# Altium schematic sheet 20220516_Keyboard_V0.2.SchDoc
size A2
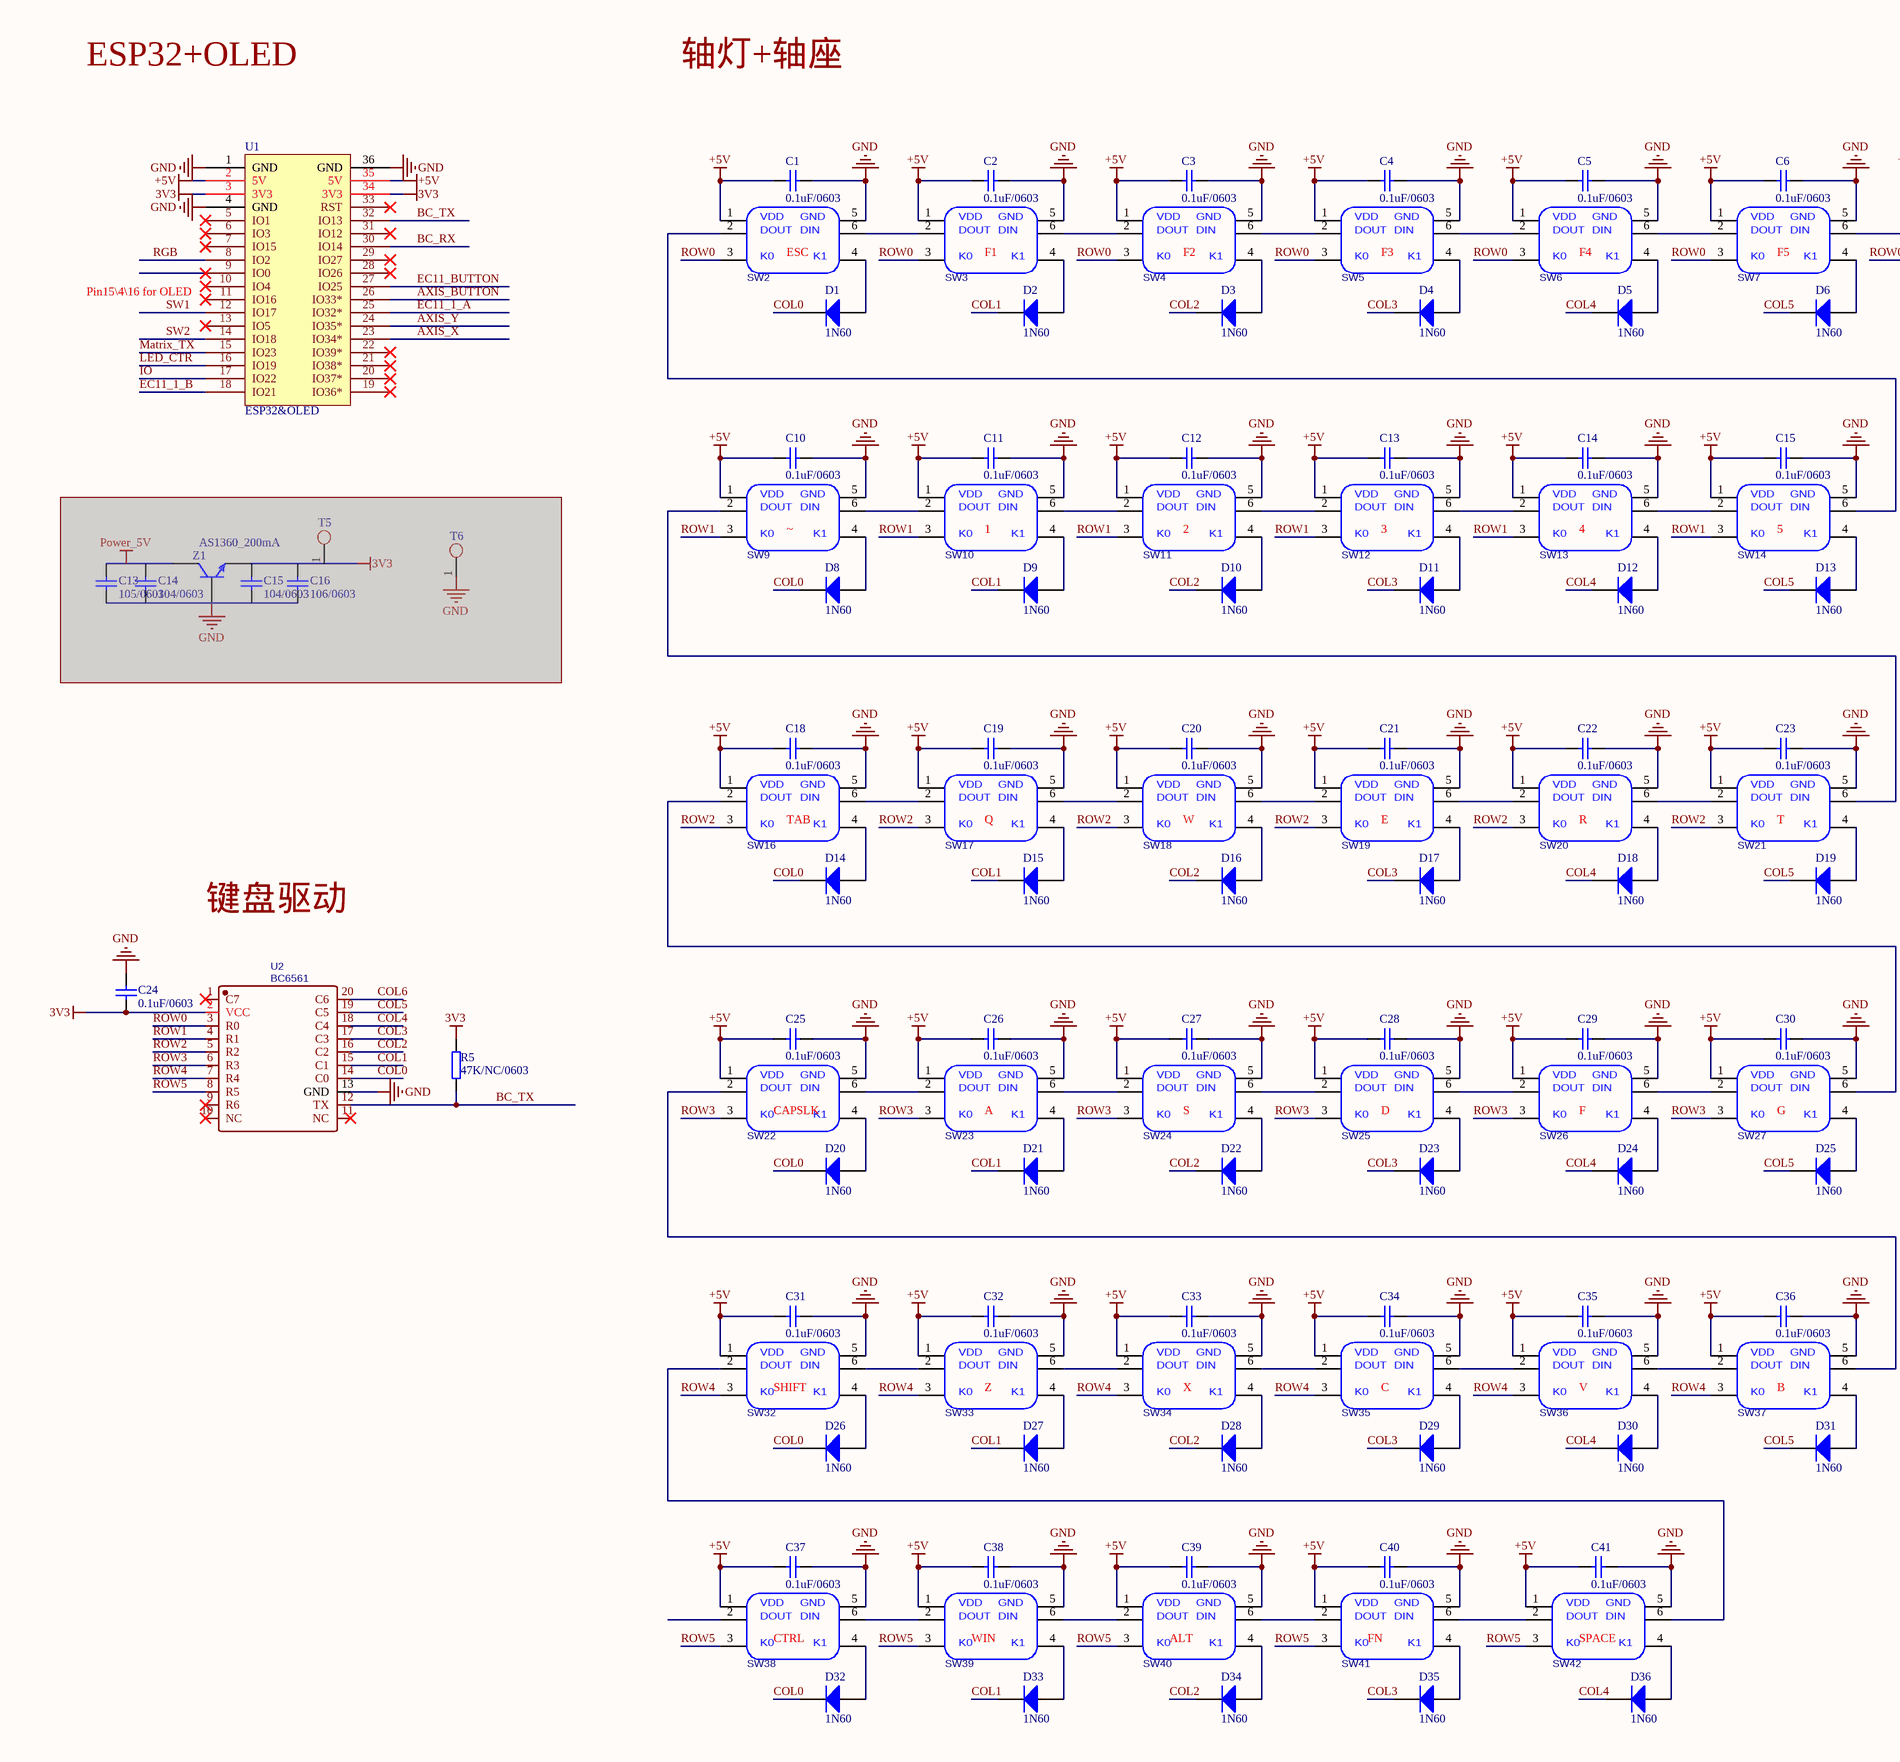
[diagram p0: 20220516_Keyboard_V0.2.SchDoc, left]
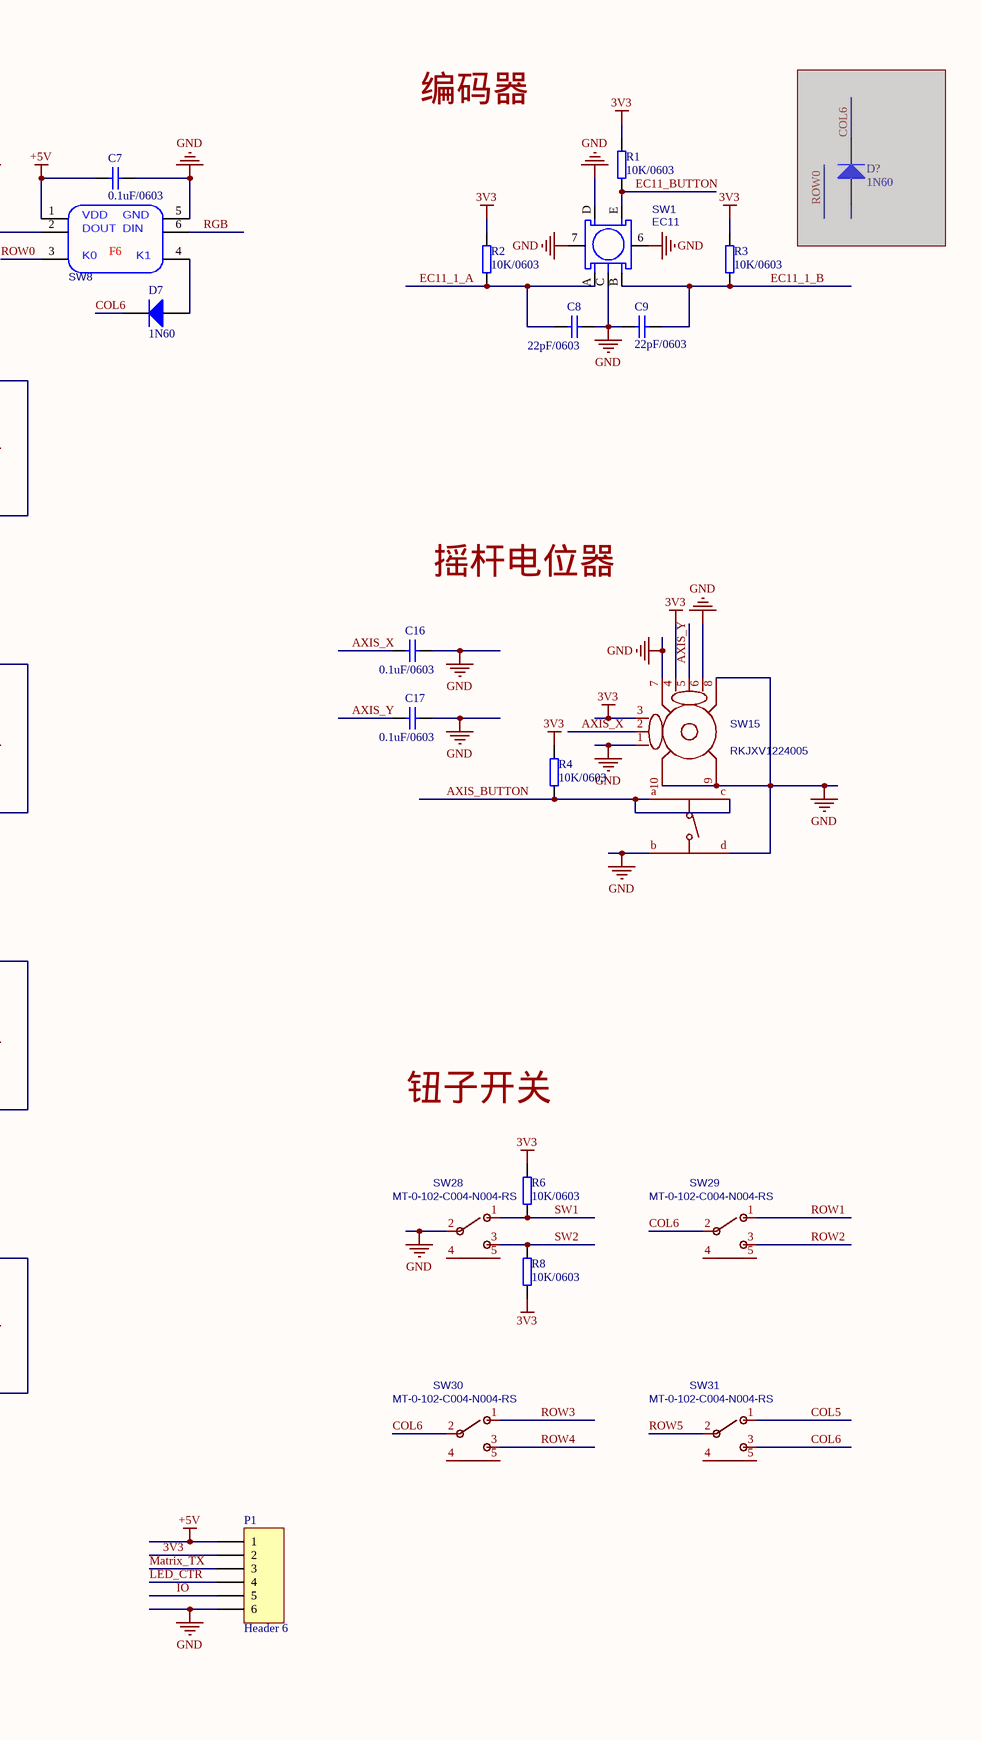
[diagram p1: 20220516_Keyboard_V0.2.SchDoc, right]

## Parts
(Parts that share a designator on the sheet are numbered #1, #2 ... from top to bottom, then left to right.)
C1  0.1uF/0603  [C 0603_L]
C2  0.1uF/0603  [C 0603_L]
C3  0.1uF/0603  [C 0603_L]
C4  0.1uF/0603  [C 0603_L]
C5  0.1uF/0603  [C 0603_L]
C6  0.1uF/0603  [C 0603_L]
C7  0.1uF/0603  [C 0603_L]
C8  22pF/0603  [C 0603_L]
C9  22pF/0603  [C 0603_L]
C10  0.1uF/0603  [C 0603_L]
C11  0.1uF/0603  [C 0603_L]
C12  0.1uF/0603  [C 0603_L]
C13#1  0.1uF/0603  [C 0603_L]
C13#2  105/0603  [C0603]  (masked out: inside a compile mask, not in the netlist)
C14#1  0.1uF/0603  [C 0603_L]
C14#2  104/0603  [C0603]  (masked out: inside a compile mask, not in the netlist)
C15#1  0.1uF/0603  [C 0603_L]
C15#2  104/0603  [C0603]  (masked out: inside a compile mask, not in the netlist)
C16#1  106/0603  [C0603]  (masked out: inside a compile mask, not in the netlist)
C16#2  0.1uF/0603  [C 0603_L]
C17  0.1uF/0603  [C 0603_L]
C18  0.1uF/0603  [C 0603_L]
C19  0.1uF/0603  [C 0603_L]
C20  0.1uF/0603  [C 0603_L]
C21  0.1uF/0603  [C 0603_L]
C22  0.1uF/0603  [C 0603_L]
C23  0.1uF/0603  [C 0603_L]
C24  0.1uF/0603  [C 0603_L]
C25  0.1uF/0603  [C 0603_L]
C26  0.1uF/0603  [C 0603_L]
C27  0.1uF/0603  [C 0603_L]
C28  0.1uF/0603  [C 0603_L]
C29  0.1uF/0603  [C 0603_L]
C30  0.1uF/0603  [C 0603_L]
C31  0.1uF/0603  [C 0603_L]
C32  0.1uF/0603  [C 0603_L]
C33  0.1uF/0603  [C 0603_L]
C34  0.1uF/0603  [C 0603_L]
C35  0.1uF/0603  [C 0603_L]
C36  0.1uF/0603  [C 0603_L]
C37  0.1uF/0603  [C 0603_L]
C38  0.1uF/0603  [C 0603_L]
C39  0.1uF/0603  [C 0603_L]
C40  0.1uF/0603  [C 0603_L]
C41  0.1uF/0603  [C 0603_L]
D1  1N60  [SOD-323]
D2  1N60  [SOD-323]
D3  1N60  [SOD-323]
D4  1N60  [SOD-323]
D5  1N60  [SOD-323]
D6  1N60  [SOD-323]
D7  1N60  [SOD-323]
D8  1N60  [SOD-323]
D9  1N60  [SOD-323]
D10  1N60  [SOD-323]
D11  1N60  [SOD-323]
D12  1N60  [SOD-323]
D13  1N60  [SOD-323]
D14  1N60  [SOD-323]
D15  1N60  [SOD-323]
D16  1N60  [SOD-323]
D17  1N60  [SOD-323]
D18  1N60  [SOD-323]
D19  1N60  [SOD-323]
D20  1N60  [SOD-323]
D21  1N60  [SOD-323]
D22  1N60  [SOD-323]
D23  1N60  [SOD-323]
D24  1N60  [SOD-323]
D25  1N60  [SOD-323]
D26  1N60  [SOD-323]
D27  1N60  [SOD-323]
D28  1N60  [SOD-323]
D29  1N60  [SOD-323]
D30  1N60  [SOD-323]
D31  1N60  [SOD-323]
D32  1N60  [SOD-323]
D33  1N60  [SOD-323]
D34  1N60  [SOD-323]
D35  1N60  [SOD-323]
D36  1N60  [SOD-323]
D?  1N60  [SOD-323]  (masked out: inside a compile mask, not in the netlist)
P1  Header 6  [HDR1X6]
R1  10K/0603  [R 0603_M]
R2  10K/0603  [R 0603_M]
R3  10K/0603  [R 0603_M]
R4  10K/0603  [R 0603_M]
R5  47K/NC/0603  [R 0603_M]
R6  10K/0603  [R 0603_M]
R8  10K/0603  [R 0603_M]
SW1  EC11  [EC11-B1]
SW2  凯华轴座+3528反贴灯  [轴座+3528反贴灯]  (value not drawn)
SW3  凯华轴座+3528反贴灯  [轴座+3528反贴灯]  (value not drawn)
SW4  凯华轴座+3528反贴灯  [轴座+3528反贴灯]  (value not drawn)
SW5  凯华轴座+3528反贴灯  [轴座+3528反贴灯]  (value not drawn)
SW6  凯华轴座+3528反贴灯  [轴座+3528反贴灯]  (value not drawn)
SW7  凯华轴座+3528反贴灯  [轴座+3528反贴灯]  (value not drawn)
SW8  凯华轴座+3528反贴灯  [轴座+3528反贴灯]  (value not drawn)
SW9  凯华轴座+3528反贴灯  [轴座+3528反贴灯]  (value not drawn)
SW10  凯华轴座+3528反贴灯  [轴座+3528反贴灯]  (value not drawn)
SW11  凯华轴座+3528反贴灯  [轴座+3528反贴灯]  (value not drawn)
SW12  凯华轴座+3528反贴灯  [轴座+3528反贴灯]  (value not drawn)
SW13  凯华轴座+3528反贴灯  [轴座+3528反贴灯]  (value not drawn)
SW14  凯华轴座+3528反贴灯  [轴座+3528反贴灯]  (value not drawn)
SW15  RKJXV1224005  [摇杆电位器]
SW16  凯华轴座+3528反贴灯  [轴座+3528反贴灯]  (value not drawn)
SW17  凯华轴座+3528反贴灯  [轴座+3528反贴灯]  (value not drawn)
SW18  凯华轴座+3528反贴灯  [轴座+3528反贴灯]  (value not drawn)
SW19  凯华轴座+3528反贴灯  [轴座+3528反贴灯]  (value not drawn)
SW20  凯华轴座+3528反贴灯  [轴座+3528反贴灯]  (value not drawn)
SW21  凯华轴座+3528反贴灯  [轴座+3528反贴灯]  (value not drawn)
SW22  凯华轴座+3528反贴灯  [轴座+3528反贴灯]  (value not drawn)
SW23  凯华轴座+3528反贴灯  [轴座+3528反贴灯]  (value not drawn)
SW24  凯华轴座+3528反贴灯  [轴座+3528反贴灯]  (value not drawn)
SW25  凯华轴座+3528反贴灯  [轴座+3528反贴灯]  (value not drawn)
SW26  凯华轴座+3528反贴灯  [轴座+3528反贴灯]  (value not drawn)
SW27  凯华轴座+3528反贴灯  [轴座+3528反贴灯]  (value not drawn)
SW28  MT-0-102-C004-N004-RS  [钮子开关三脚二档]
SW29  MT-0-102-C004-N004-RS  [钮子开关三脚二档]
SW30  MT-0-102-C004-N004-RS  [钮子开关三脚二档]
SW31  MT-0-102-C004-N004-RS  [钮子开关三脚二档]
SW32  凯华轴座+3528反贴灯  [轴座+3528反贴灯]  (value not drawn)
SW33  凯华轴座+3528反贴灯  [轴座+3528反贴灯]  (value not drawn)
SW34  凯华轴座+3528反贴灯  [轴座+3528反贴灯]  (value not drawn)
SW35  凯华轴座+3528反贴灯  [轴座+3528反贴灯]  (value not drawn)
SW36  凯华轴座+3528反贴灯  [轴座+3528反贴灯]  (value not drawn)
SW37  凯华轴座+3528反贴灯  [轴座+3528反贴灯]  (value not drawn)
SW38  凯华轴座+3528反贴灯  [轴座+3528反贴灯]  (value not drawn)
SW39  凯华轴座+3528反贴灯  [轴座+3528反贴灯]  (value not drawn)
SW40  凯华轴座+3528反贴灯  [轴座+3528反贴灯]  (value not drawn)
SW41  凯华轴座+3528反贴灯  [轴座+3528反贴灯]  (value not drawn)
SW42  凯华轴座+3528反贴灯  [轴座+3528反贴灯]  (value not drawn)
T5  (no value)  [test-1]  (masked out: inside a compile mask, not in the netlist)
T6  (no value)  [test-1]  (masked out: inside a compile mask, not in the netlist)
U1  ESP32&OLED  [ESP32+OLED]
U2  BC6561  [SSOP-20_L7.5-W5.2-P0.65-LS8.0-BL]
Z1  AS1360_200mA  [SOT-23]  (masked out: inside a compile mask, not in the netlist)

## Nets
3V3: C24.2 P1.2 R1.1 R2.1 R3.2 R4.1 R5.1 R6.1 R8.1 SW15.3(A) SW15.4(A) U1.3(3V3) U1.34(3V3) U2.2(VCC)
+5V: C1.2 C2.2 C3.2 C4.2 C5.2 C6.2 C7.2 C10.2 C11.2 C12.2 C13#1.2 C14#1.2 C15#1.2 C18.2 C19.2 C20.2 C21.2 C22.2 C23.2 C25.2 C26.2 C27.2 C28.2 C29.2 C30.2 C31.2 C32.2 C33.2 C34.2 C35.2 C36.2 C37.2 C38.2 C39.2 C40.2 C41.2 P1.1 SW2.1 SW3.1 SW4.1 SW5.1 SW6.1 SW7.1 SW8.1 SW9.1 SW10.1 SW11.1 SW12.1 SW13.1 SW14.1 SW16.1 SW17.1 SW18.1 SW19.1 SW20.1 SW21.1 SW22.1 SW23.1 SW24.1 SW25.1 SW26.1 SW27.1 SW32.1 SW33.1 SW34.1 SW35.1 SW36.1 SW37.1 SW38.1 SW39.1 SW40.1 SW41.1 SW42.1 U1.2(5V) U1.35(5V)
GND: C1.1 C2.1 C3.1 C4.1 C5.1 C6.1 C7.1 C8.1 C9.2 C10.1 C11.1 C12.1 C13#1.1 C14#1.1 C15#1.1 C16#2.1 C17.1 C18.1 C19.1 C20.1 C21.1 C22.1 C23.1 C24.1 C25.1 C26.1 C27.1 C28.1 C29.1 C30.1 C31.1 C32.1 C33.1 C34.1 C35.1 C36.1 C37.1 C38.1 C39.1 C40.1 C41.1 P1.6 SW1.6 SW1.7 SW1.C SW1.D SW2.5 SW3.5 SW4.5 SW5.5 SW6.5 SW7.5 SW8.5 SW9.5 SW10.5 SW11.5 SW12.5 SW13.5 SW14.5 SW15.1(B) SW15.6(B) SW15.7(GND) SW15.8(GND) SW15.9(GND) SW15.10(GND) SW15.b SW15.d SW16.5 SW17.5 SW18.5 SW19.5 SW20.5 SW21.5 SW22.5 SW23.5 SW24.5 SW25.5 SW26.5 SW27.5 SW28.2 SW32.5 SW33.5 SW34.5 SW35.5 SW36.5 SW37.5 SW38.5 SW39.5 SW40.5 SW41.5 SW42.5 U1.1(GND) U1.4(GND) U1.36(GND) U2.13(GND)
AXIS_BUTTON: R4.2 SW15.a SW15.c U1.26(IO33*)
AXIS_X: C16#2.2 SW15.2(DTA) U1.23(IO34*)
AXIS_Y: C17.2 SW15.5(DTA) U1.24(IO35*)
BC_RX: U1.30(IO14)
BC_TX: R5.2 U1.32(IO13) U2.12(TX)
COL0: D1.2 D8.2 D14.2 D20.2 D26.2 D32.2 U2.14(C0)
COL1: D2.2 D9.2 D15.2 D21.2 D27.2 D33.2 U2.15(C1)
COL2: D3.2 D10.2 D16.2 D22.2 D28.2 D34.2 U2.16(C2)
COL3: D4.2 D11.2 D17.2 D23.2 D29.2 D35.2 U2.17(C3)
COL4: D5.2 D12.2 D18.2 D24.2 D30.2 D36.2 U2.18(C4)
COL5: D6.2 D13.2 D19.2 D25.2 D31.2 SW31.1 U2.19(C5)
COL6: D7.2 SW29.2 SW30.2 SW31.3 U2.20(C6)
EC11_1_A: C8.2 R2.2 SW1.A U1.25(IO32*)
EC11_1_B: C9.1 R3.1 SW1.B U1.18(IO21)
EC11_BUTTON: R1.2 SW1.E U1.27(IO25)
IO: P1.5 U1.17(IO22)
LED_CTR: P1.4 U1.16(IO19)
Matrix_TX: P1.3 U1.15(IO23)
RGB: SW8.6 U1.8(IO2)
ROW0: SW2.3 SW3.3 SW4.3 SW5.3 SW6.3 SW7.3 SW8.3 U2.3(R0)
ROW1: SW9.3 SW10.3 SW11.3 SW12.3 SW13.3 SW14.3 SW29.1 U2.4(R1)
ROW2: SW16.3 SW17.3 SW18.3 SW19.3 SW20.3 SW21.3 SW29.3 U2.5(R2)
ROW3: SW22.3 SW23.3 SW24.3 SW25.3 SW26.3 SW27.3 SW30.1 U2.6(R3)
ROW4: SW30.3 SW32.3 SW33.3 SW34.3 SW35.3 SW36.3 SW37.3 U2.7(R4)
ROW5: SW31.2 SW38.3 SW39.3 SW40.3 SW41.3 SW42.3 U2.8(R5)
SW1: R6.2 SW28.1 U1.12(IO17)
SW2: R8.2 SW28.3 U1.14(IO18)
NetD1_1: D1.1 SW2.4
NetD2_1: D2.1 SW3.4
NetD3_1: D3.1 SW4.4
NetD4_1: D4.1 SW5.4
NetD5_1: D5.1 SW6.4
NetD6_1: D6.1 SW7.4
NetD7_1: D7.1 SW8.4
NetD8_1: D8.1 SW9.4
NetD9_1: D9.1 SW10.4
NetD10_1: D10.1 SW11.4
NetD11_1: D11.1 SW12.4
NetD12_1: D12.1 SW13.4
NetD13_1: D13.1 SW14.4
NetD14_1: D14.1 SW16.4
NetD15_1: D15.1 SW17.4
NetD16_1: D16.1 SW18.4
NetD17_1: D17.1 SW19.4
NetD18_1: D18.1 SW20.4
NetD19_1: D19.1 SW21.4
NetD20_1: D20.1 SW22.4
NetD21_1: D21.1 SW23.4
NetD22_1: D22.1 SW24.4
NetD23_1: D23.1 SW25.4
NetD24_1: D24.1 SW26.4
NetD25_1: D25.1 SW27.4
NetD26_1: D26.1 SW32.4
NetD27_1: D27.1 SW33.4
NetD28_1: D28.1 SW34.4
NetD29_1: D29.1 SW35.4
NetD30_1: D30.1 SW36.4
NetD31_1: D31.1 SW37.4
NetD32_1: D32.1 SW38.4
NetD33_1: D33.1 SW39.4
NetD34_1: D34.1 SW40.4
NetD35_1: D35.1 SW41.4
NetD36_1: D36.1 SW42.4
NetSW2_2: SW2.2 SW14.6
NetSW2_6: SW2.6 SW3.2
NetSW3_6: SW3.6 SW4.2
NetSW4_6: SW4.6 SW5.2
NetSW5_6: SW5.6 SW6.2
NetSW6_6: SW6.6 SW7.2
NetSW7_6: SW7.6 SW8.2
NetSW9_2: SW9.2 SW21.6
NetSW9_6: SW9.6 SW10.2
NetSW10_6: SW10.6 SW11.2
NetSW11_6: SW11.6 SW12.2
NetSW12_6: SW12.6 SW13.2
NetSW13_6: SW13.6 SW14.2
NetSW16_2: SW16.2 SW27.6
NetSW16_6: SW16.6 SW17.2
NetSW17_6: SW17.6 SW18.2
NetSW18_6: SW18.6 SW19.2
NetSW19_6: SW19.6 SW20.2
NetSW20_6: SW20.6 SW21.2
NetSW22_2: SW22.2 SW37.6
NetSW22_6: SW22.6 SW23.2
NetSW23_6: SW23.6 SW24.2
NetSW24_6: SW24.6 SW25.2
NetSW25_6: SW25.6 SW26.2
NetSW26_6: SW26.6 SW27.2
NetSW32_2: SW32.2 SW42.6
NetSW32_6: SW32.6 SW33.2
NetSW33_6: SW33.6 SW34.2
NetSW34_6: SW34.6 SW35.2
NetSW35_6: SW35.6 SW36.2
NetSW36_6: SW36.6 SW37.2
NetSW38_6: SW38.6 SW39.2
NetSW39_6: SW39.6 SW40.2
NetSW40_6: SW40.6 SW41.2
NetSW41_6: SW41.6 SW42.2

Not connected (* = marked no-connect by the designer): SW28 4 5; SW29 4 5; SW30 4 5; SW31 4 5; SW38 2; U1 5(IO1)* 6(IO3)* 7(IO15)* 9(IO0)* 10(IO4)* 11(IO16)* 13(IO5)* 19(IO36*)* 20(IO37*)* 21(IO38*)* 22(IO39*)* 28(IO26)* 29(IO27)* 31(IO12)* 33(RST)*; U2 1(C7)* 9(R6)* 10(NC)* 11(NC)*

## Notes on the sheet
- ESP32+OLED
- 轴灯+轴座
- 编码器
- (near SW2) ESC
- (near SW3) F1
- (near SW4) F2
- (near SW5) F3
- (near SW6) F4
- (near SW7) F5
- (near SW8) F6
- (near U1) Pin15\4\16 for OLED
- (near SW9) ~
- (near SW10) 1
- (near SW11) 2
- (near SW12) 3
- (near SW13) 4
- (near SW14) 5
- 摇杆电位器
- (near SW16) TAB
- (near SW17) Q
- (near SW18) W
- (near SW19) E
- (near SW20) R
- (near SW21) T
- 键盘驱动
- (near SW22) CAPSLK
- (near SW23) A
- (near SW24) S
- (near SW25) D
- (near SW26) F
- (near SW27) G
- 钮子开关
- (near SW32) SHIFT
- (near SW33) Z
- (near SW34) X
- (near SW35) C
- (near SW36) V
- (near SW37) B
- (near SW38) CTRL
- (near SW39) WIN
- (near SW40) ALT
- (near SW41) FN
- (near SW42) SPACE
- (in symbol 凯华轴座+3528反贴灯) VDD; GND; DOUT; DIN; K0; K1

## Library data of the parts
C1-C12 C13#1 C14#1 C15#1 C16#2 C17-C41 = Cap: Capacitor; Published: 8-Jun-2000; LatestRevisionDate: 17-Jul-2002; LatestRevisionNote: Re-released for DXP Platform.; PackageReference: RAD-0.3; Publisher: Altium Limited; PackageDescription: Radial Cap, Thru-Hole; 2 Leads; 0.3 in Pin Spacing
C13#2 C14#2 C15#2 C16#1 = Cap: Capacitor; Value: 0.1uF; Published: 8-Jun-2000; LatestRevisionDate: 17-Jul-2002; LatestRevisionNote: Re-released for DXP Platform.; PackageReference: RAD-0.3; Publisher: Altium Limited; PackageDescription: Radial Cap, Thru-Hole; 2 Leads; 0.3 in Pin Spacing
D1-D36 D? = Diode: Default Diode; Published: 8-Jun-2000; LatestRevisionDate: 17-Jul-2002; LatestRevisionNote: Re-released for DXP Platform.; PackageVersion: Sep-1996; PackageReference: SMC; Publisher: Altium Limited; PackageDescription: DO-214-AB/SMC; 2 C-Bend Leads; Body 7.9 x 5.9 mm, inc. leads (LxW); Code_JEDEC: DO-214-AB
P1 = Header 6: Header, 6-Pin; LatestRevisionDate: 17-Jul-2002; LatestRevisionNote: Re-released for DXP Platform.; Publisher: Altium Limited
R1-R6 R8 = R: 电阻; Value: 1K; Published: 8-Jun-2000; LatestRevisionDate: 17-Jul-2002; LatestRevisionNote: Re-released for DXP Platform.; PackageReference: AXIAL-0.4; Publisher: Altium Limited; PackageDescription: Axial Device, Thru-Hole; 2 Leads; 0.4 in Pin Spacing
SW1 = EC11: subpart_no: 1; Contributor: lijianli; spicePre: S; spiceSymbolName: EC11 360° 20定位 20脉冲 半轴柄长30MM COPY COPY
SW2-SW14 SW16-SW27 SW32-SW42 = 凯华轴座+3528反贴灯: Contributor: LAN_23333; spicePre: S; spiceSymbolName: 凯华轴座+3528反贴灯
SW15 = RKJXV1224005: BOM_Manufacturer: ALPS Electric; Contributor: LCSC; BOM_Supplier: LCSC; BOM_Supplier Part: C146170; BOM_Manufacturer Part: RKJXV1224005; BOM_JLCPCB Part Class: Extended Part; spicePre: S; spiceSymbolName: RKJXV1224005
SW28-SW31 = MT-0-102-C004-N004-RS: BOM_Manufacturer: YUEN FUNG(源丰); Contributor: LCSC; BOM_Supplier: LCSC; BOM_Supplier Part: C1788496; BOM_Manufacturer Part: MT-0-102-C004-N004-RS; BOM_JLCPCB Part Class: Extended Part; spicePre: S; spiceSymbolName: MT-0-102-C004-N004-RS
T5 T6 = 测试点
U2 = TLC1543IDBR: BOM_Manufacturer: TI(德州仪器); Contributor: LCSC; BOM_Supplier: LCSC; BOM_Supplier Part: C2670240; BOM_Manufacturer Part: TLC1543IDBR; BOM_JLCPCB Part Class: Extended Part; spicePre: U; spiceSymbolName: TLC1543IDBR
Z1 = NPN: NPN Bipolar Transistor; Published: 8-Jun-2000; LatestRevisionDate: 17-Jul-2002; LatestRevisionNote: Re-released for DXP Platform.; PackageReference: TO-226; Publisher: Altium Limited; Code_JEDEC: TO-226-AA